# Altium schematic sheet Knobber_Topsheet.SchDoc
size A3; SheetNumber: 1; SheetTotal: 1
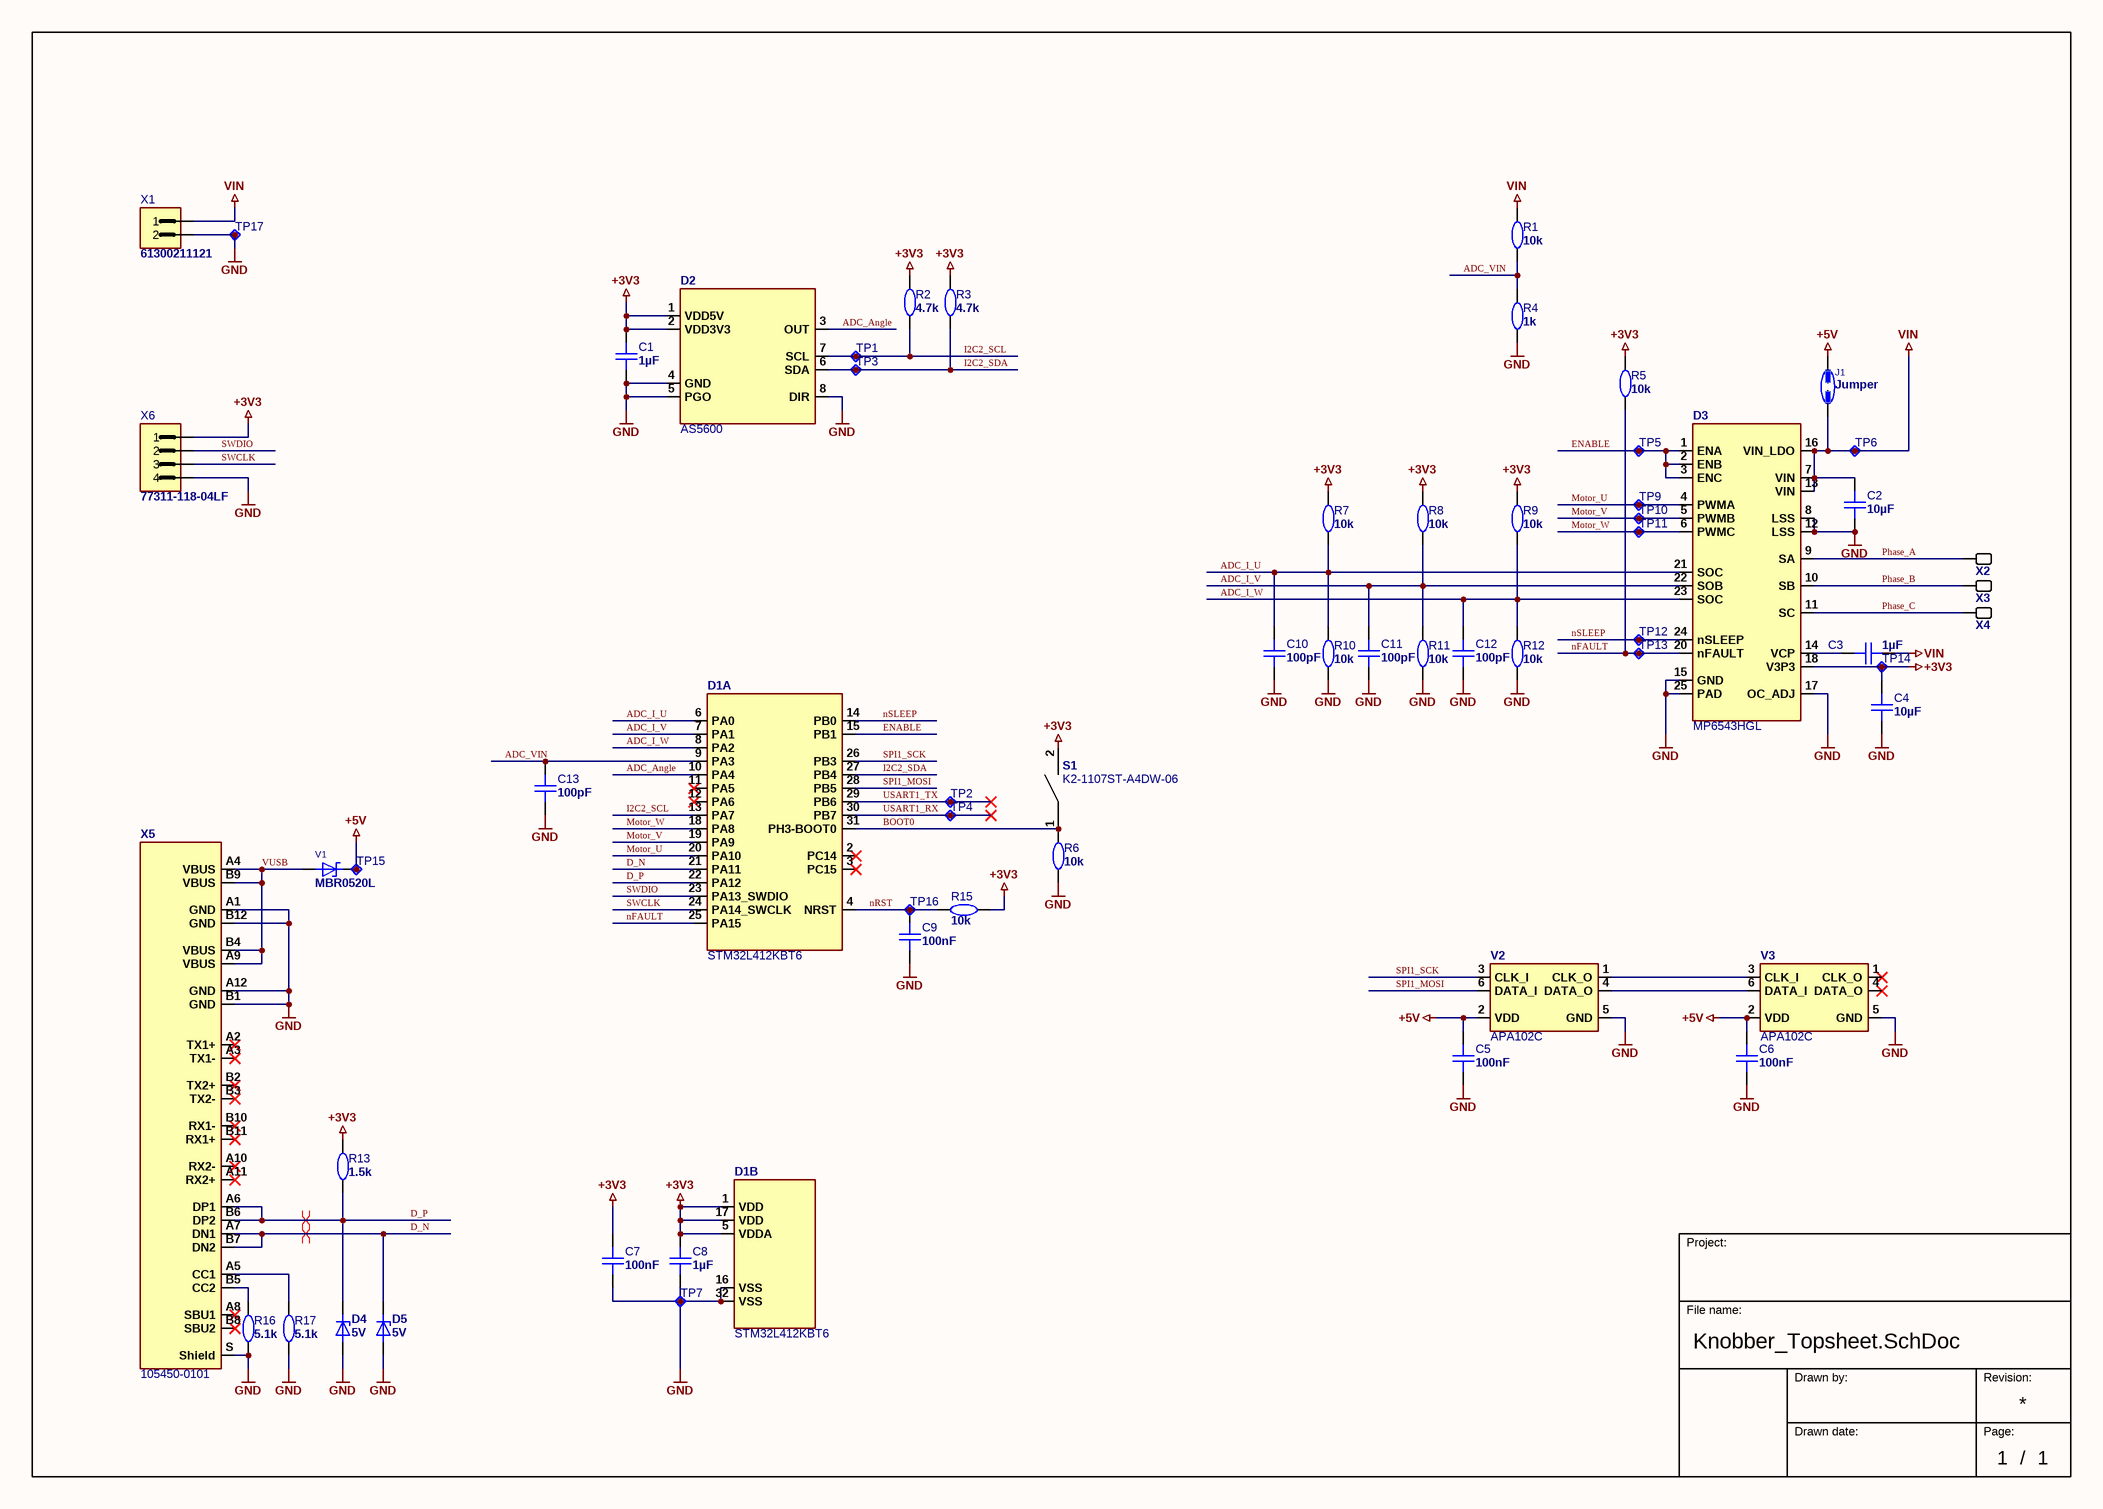
[diagram p0: Knobber_Topsheet.SchDoc]

## Parts
C1  value 1µF  [C-0603_1608_095_L_RF]  (hidden comment: Cap 1u 0603)
C2  value 10µF  [C-1210_3225_230_L_RF]  (hidden comment: CAP 10u 1210)
C3  value 1µF  [C-0603_1608_095_L_RF]  (hidden comment: Cap 1u 0603)
C4  value 10µF  [C-0805_2012_145_L_RF]  (hidden comment: CAP 10u 16V 0805)
C5  value 100nF  [C-0603_1608_095_L_RF]  (hidden comment: Cap 100n 0603)
C6  value 100nF  [C-0603_1608_095_L_RF]  (hidden comment: Cap 100n 0603)
C7  value 100nF  [C-0603_1608_095_L_RF]  (hidden comment: Cap 100n 0603)
C8  value 1µF  [C-0603_1608_095_L_RF]  (hidden comment: Cap 1u 0603)
C9  value 100nF  [C-0603_1608_095_L_RF]  (hidden comment: Cap 100n 0603)
C10  value 100pF  [C-0603_1608_095_L_RF]  (hidden comment: Cap 100p 0603)
C11  value 100pF  [C-0603_1608_095_L_RF]  (hidden comment: Cap 100p 0603)
C12  value 100pF  [C-0603_1608_095_L_RF]  (hidden comment: Cap 100p 0603)
C13  value 100pF  [C-0603_1608_095_L_RF]  (hidden comment: Cap 100p 0603)
D1  STM32L412KBT6  [LQFP32_N_RF]  (parts A,B of 2)
D2  AS5600  [SOIC8_N_RF]
D3  MP6543HGL  [QFN24_5x7_N_RF]
D4  5V  [SOD-923_N_RF]
D5  5V  [SOD-923_N_RF]
J1  value Jumper  [J-1206_Solderjumper_2Pin]  (hidden comment: Solder jumper 2Pin)  (no BOM)
R1  value 10k  [R-0603_1608_050_L_RF]  (hidden comment: Res 10k 0603)
R2  value 4.7k  [R-0603_1608_050_L_RF]  (hidden comment: Res 4k7 0603)
R3  value 4.7k  [R-0603_1608_050_L_RF]  (hidden comment: Res 4k7 0603)
R4  value 1k  [R-0603_1608_050_L_RF]  (hidden comment: Res 1k 0603)
R5  value 10k  [R-0603_1608_050_L_RF]  (hidden comment: Res 10k 0603)
R6  value 10k  [R-0603_1608_050_L_RF]  (hidden comment: Res 10k 0603)
R7  value 10k  [R-0603_1608_050_L_RF]  (hidden comment: Res 10k 0603)
R8  value 10k  [R-0603_1608_050_L_RF]  (hidden comment: Res 10k 0603)
R9  value 10k  [R-0603_1608_050_L_RF]  (hidden comment: Res 10k 0603)
R10  value 10k  [R-0603_1608_050_L_RF]  (hidden comment: Res 10k 0603)
R11  value 10k  [R-0603_1608_050_L_RF]  (hidden comment: Res 10k 0603)
R12  value 10k  [R-0603_1608_050_L_RF]  (hidden comment: Res 10k 0603)
R13  value 1.5k  [R-0603_1608_050_L_RF]  (hidden comment: Res 1k5 0603)
R15  value 10k  [R-0603_1608_050_L_RF]  (hidden comment: Res 10k 0603)
R16  value 5.1k  [R-0603_1608_050_L_RF]  (hidden comment: Res 5k1 0603)
R17  value 5.1k  [R-0603_1608_050_L_RF]  (hidden comment: Res 5k1 0603)
S1  K2-1107ST-A4DW-06  [K2-1107ST-A4DW-06]
TP1  TestPoint 0.8mm  [TP_0.8mm]  (value not drawn)  (no BOM)
TP2  TestPoint 0.8mm  [TP_0.8mm]  (value not drawn)  (no BOM)
TP3  TestPoint 0.8mm  [TP_0.8mm]  (value not drawn)  (no BOM)
TP4  TestPoint 0.8mm  [TP_0.8mm]  (value not drawn)  (no BOM)
TP5  TestPoint 0.8mm  [TP_0.8mm]  (value not drawn)  (no BOM)
TP6  TestPoint 0.8mm  [TP_0.8mm]  (value not drawn)  (no BOM)
TP7  TestPoint 0.8mm  [TP_0.8mm]  (value not drawn)  (no BOM)
TP9  TestPoint 0.8mm  [TP_0.8mm]  (value not drawn)  (no BOM)
TP10  TestPoint 0.8mm  [TP_0.8mm]  (value not drawn)  (no BOM)
TP11  TestPoint 0.8mm  [TP_0.8mm]  (value not drawn)  (no BOM)
TP12  TestPoint 0.8mm  [TP_0.8mm]  (value not drawn)  (no BOM)
TP13  TestPoint 0.8mm  [TP_0.8mm]  (value not drawn)  (no BOM)
TP14  TestPoint 0.8mm  [TP_0.8mm]  (value not drawn)  (no BOM)
TP15  TestPoint 0.8mm  [TP_0.8mm]  (value not drawn)  (no BOM)
TP16  TestPoint 0.8mm  [TP_0.8mm]  (value not drawn)  (no BOM)
TP17  TestPoint 0.8mm  [TP_0.8mm]  (value not drawn)  (no BOM)
V1  MBR0520L  [SOD123_L_RF]
V2  APA102C  [V_2020_P6_N_RF]
V3  APA102C  [V_2020_P6_N_RF]
X1  value 61300211121  [X-0508X0254_R_WE_61300211121]  (hidden comment: CONN HEADER 2POS 1ROW THT 2.54MM)
X2  (no value)  [Lötpad_2x3]  (no BOM)
X3  (no value)  [Lötpad_2x3]  (no BOM)
X4  (no value)  [Lötpad_2x3]  (no BOM)
X5  105450-0101  [105450-0101]
X6  value 77311-118-04LF  [X-0101X0025_R_FCI_77311-118-04LF]  (hidden comment: CONN HEADER 4POS 1ROW THT 2.54MM)

## Nets
+3V3: C1.2 C4.2 C7.2 C8.2 D1.1(VDD) D1.5(VDDA) D1.17(VDD) D2.1(VDD5V) D2.2(VDD3V3) D3.18(V3P3) R2.2 R3.2 R5.2 R7.2 R8.2 R9.2 R13.2 R15.1 S1.2 TP14.1 X6.1
+5V: C5.2 C6.2 J1.2 TP15.1 V1.2 V2.2(VDD) V3.2(VDD)
GND: C1.1 C2.1 C4.1 C5.1 C6.1 C7.1 C8.1 C9.1 C10.1 C11.1 C12.1 C13.1 D1.16(VSS) D1.32(VSS) D2.4(GND) D2.5(PGO) D2.8(DIR) D3.8(LSS) D3.12(LSS) D3.15(GND) D3.17(OC_ADJ) D3.25(PAD) D4.1 D5.1 R4.1 R6.1 R10.1 R11.1 R12.1 R16.1 R17.1 TP7.1 TP17.1 V2.5(GND) V3.5(GND) X1.2 X5.A1(GND) X5.A12(GND) X5.B1(GND) X5.B12(GND) X5.S(Shield) X6.4
VIN: C2.2 C3.2 D3.7(VIN) D3.13(VIN) D3.16(VIN_LDO) J1.1 R1.2 TP6.1 X1.1
ADC_Angle: D1.10(PA4) D2.3(OUT)
ADC_I_U: C10.2 D1.6(PA0) D3.21(SOC) R7.1 R10.2
ADC_I_V: C11.2 D1.7(PA1) D3.22(SOB) R8.1 R11.2
ADC_I_W: C12.2 D1.8(PA2) D3.23(SOC) R9.1 R12.2
ADC_VIN: C13.2 D1.9(PA3) R1.1 R4.2
BOOT0: D1.31(PH3-BOOT0) R6.2 S1.1
D_N: D1.21(PA11) D5.2 X5.A7(DN1) X5.B7(DN2)
D_P: D1.22(PA12) D4.2 R13.1 X5.A6(DP1) X5.B6(DP2)
ENABLE: D1.15(PB1) D3.1(ENA) D3.2(ENB) D3.3(ENC) TP5.1
I2C2_SCL: D1.13(PA7) D2.7(SCL) R2.1 TP1.1
I2C2_SDA: D1.27(PB4) D2.6(SDA) R3.1 TP3.1
Motor_U: D1.20(PA10) D3.4(PWMA) TP9.1
Motor_V: D1.19(PA9) D3.5(PWMB) TP10.1
Motor_W: D1.18(PA8) D3.6(PWMC) TP11.1
nFAULT: D1.25(PA15) D3.20(nFAULT) R5.1 TP13.1
nRST: C9.2 D1.4(NRST) R15.2 TP16.1
nSLEEP: D1.14(PB0) D3.24(nSLEEP) TP12.1
Phase_A: D3.9(SA) X2.1
Phase_B: D3.10(SB) X3.1
Phase_C: D3.11(SC) X4.1
SPI1_MOSI: D1.28(PB5) V2.6(DATA_I)
SPI1_SCK: D1.26(PB3) V2.3(CLK_I)
SWCLK: D1.24(PA14_SWCLK) X6.3
SWDIO: D1.23(PA13_SWDIO) X6.2
USART1_RX: D1.30(PB7) TP4.1
USART1_TX: D1.29(PB6) TP2.1
VUSB: V1.1 X5.A4(VBUS) X5.A9(VBUS) X5.B4(VBUS) X5.B9(VBUS)
NetC3_1: C3.1 D3.14(VCP)
NetR16_2: R16.2 X5.B5(CC2)
NetR17_2: R17.2 X5.A5(CC1)
NetV2_1: V2.1(CLK_O) V3.3(CLK_I)
NetV2_4: V2.4(DATA_O) V3.6(DATA_I)

Not connected (* = marked no-connect by the designer): D1 2(PC14)* 3(PC15)* 11(PA5)* 12(PA6)*; V3 1(CLK_O)* 4(DATA_O)*; X5 A2(TX1+)* A3(TX1-)* A8(SBU1)* A10(RX2-)* A11(RX2+)* B2(TX2+)* B3(TX2-)* B8(SBU2)* B10(RX1-)* B11(RX1+)*

## Layout directives
differential pair: D_N, D_P

## Notes on the sheet
- Project:
- File name:
- Drawn by:
- Revision:
- Drawn date:
- Page:
- /

## Library data of the parts
C1 C3 C8 = CMP-001-0045-3: Cap Cer SMD 1u 16V 10% 0603 X7R; Manufacturer Part Number: 0603YC105KAT2A; Manufacturer: AVX; GPV_Number: 1749.0125; User: epph; Prefered: true; Manufacturer Part Number 2: C0603C105K4RACTU; ClassName: Surface_Assy; Technology: SMT; Manufacturer 2: KEMET; PartStatus: Release; Case / Package: 0603
C2 = CMP-001-0198-2: CAP CER 10uF 50V X7S 1210; Manufacturer: TDK; Manufacturer Part Number: C3225X7S1H106K250AE; User: zupa; GPV_Number: 1752.0100; Technology: SMT; ClassName: Surface_Assy; ComponentLink1Description: Datasheet; PartStatus: Release; ComponentLink1URL: https://datasheet.ciiva.com/24218/c3225x7s1h106k250ae-265440-24218657.pdf?src-supplier=Mouser; Case / Package: 1210
C4 = CMP-001-0177-2: Cap Cer SMD 10u 16V 10% 0805 X5R; Manufacturer Part Number: 0805YD106KAT2A; Manufacturer: AVX; Prefered: true; GPV_Number: 1750.0241; User: zupa; PartStatus: Release; ComponentLink1URL: https://datasheet.ciiva.com/152/cx5r-152114.pdf; Case / Package: 0805; ComponentLink1Description: Datasheet; Technology: SMT; ClassName: Surface_Assy
C5-C7 C9 = CMP-001-0036-2: Cap Cer SMD 100n 100V 10% 0603 X7R; Manufacturer Part Number: GRM188R72A104KA35; Manufacturer: MURATA; GPV_Number: 1749.0196; User: zupa; Prefered: false; Case / Package: 0603; ComponentLink1Description: Datasheet; PartStatus: Release; ComponentLink1URL: https://datasheet.ciiva.com/34302/1857815-34302863.pdf; ClassName: Surface_Assy; Technology: SMT
C10-C13 = CMP-001-0000-2: Cap Cer SMD 100p 50V 5% 0603 C0G; Manufacturer Part Number: CC0603J*NPO9BN101; Manufacturer: YAGEO; User: zupa; GPV_Number: 1749.0055; Prefered: false; Technology: SMT; PartStatus: Release; Case / Package: 0603; ComponentLink1Description: Datasheet; ComponentLink1URL: https://datasheet.ciiva.com/11786/0900766b8079c870-11786060.pdf; ClassName: Surface_Assy
D1 = STM32L412KBT6: IC MCU STM32; Part_validated: No; Manufacturer: STM; GPV_Number: xxxx.xxxx; MNL_Number: xxxxxxxx; Value: STM32L412KBT6; Footprint_validated: No; PartStatus: New; System: -; Case/Package: LQFP32; Technology: SMT; Manufacturer Part Number: STM32L412KBT6; ClassName: Surface_Assy
D2 = AS5600: IC Sensor Rotation Magnet 12bit; Part_validated: No; Manufacturer: AMS; GPV_Number: xxxx.xxxx; MNL_Number: xxxxxxxx; Value: AS5600; Footprint_validated: No; PartStatus: New; System: -; ClassName: Surface_Assy; Case/Package: SO-8; Technology: SMT; Manufacturer Part Number: AS5600
D3 = MP6543HGL-A-P: Motor Driver 3-Phase 3-22V 2A; Part_validated: No; Manufacturer: Monolithic Power Systems; GPV_Number: xxxx.xxxx; MNL_Number: xxxxxxxx; Value: MP6543HGL; Footprint_validated: No; PartStatus: New; System: -; ClassName: Surface_Assy; Case/Package: QFN-24; Technology: SMT; Manufacturer Part Number: MP6543HGL-A-P
D4 D5 = ESD9101: Diode ESD 5V; Part_validated: Yes | No; Manufacturer: Onsemi; Manufacturer Part Number: ESD9101P2T5G; GPV_Number: xxxx.xxxx; MNL_Number: xxxxxxxx; Value: 5V; Footprint_validated: Yes | No; PartStatus: New | Draft | Release; System: -; ClassName: Surface_Assy | Testpoint | Through-Hole_Assy | NetTie | Symbol | Mechanical; Case/Package: 0201 | 0402 | 0603 | 0805 | 1206 | SO8 | SO16 |; Technology: SMT | THT | SMT-BTC
J1 = CMP-00136-2: User: epph; PartStatus: Release; ClassName: Surface_Assy; Technology: SYM
R1 R5-R12 R15 = CMP-001-0241-4: Res SMD 10k 1% 0.1W 0603; Manufacturer: KOA; Manufacturer Part Number: RK73H1JTTD1002F; GPV_Number: 1922.0100; User: epph; Prefered: true; Case / Package: 0603; ClassName: Surface_Assy; PartStatus: Release; Technology: SMT; Manufacturer Part Number 3: RC0603FR-0710KL; Manufacturer 3: YAGEO; Manufacturer 2: Vishay; Manufacturer Part Number 2: CRCW060310K0FKEA
R2 R3 = CMP-001-0274-3: Res SMD 4k7 1% 0.1W 0603; Manufacturer Part Number: RC0603FR-074K7L; Manufacturer: YAGEO; GPV_Number: 1922.0017; Prefered: true; MNL_Number: 15347012; User: zupa; ComponentLink1Description: Datasheet; ComponentLink1URL: https://datasheet.ciiva.com/11808/0900766b80f96399-11808280.pdf; ClassName: Surface_Assy; PartStatus: Release; Case / Package: 0603; Technology: SMT
R4 = CMP-001-0250-3: Res SMD 1k 1% 0.1W 0603; Manufacturer: YAGEO; Manufacturer Part Number: RC0603FR-071KL; MNL_Number: 15310012; User: zupa; GPV_Number: 1922.0011; Prefered: true; Technology: SMT; ComponentLink1Description: Datasheet; ClassName: Surface_Assy; ComponentLink1URL: https://datasheet.ciiva.com/11808/0900766b80f96399-11808280.pdf; Case / Package: 0603; PartStatus: Release
R13 = CMP-001-0572-4: Res SMD 1k5 1% 0.1W 0603; Manufacturer: YAGEO; Manufacturer Part Number: RC0603FR-071K5L; User: epph; Prefered: true; GPV_Number: 1922.0480; Manufacturer 2: KOA; Case / Package: 0603; PartStatus: Release; Manufacturer 3: Vishay; Technology: SMT; ClassName: Surface_Assy; Manufacturer Part Number 3: CRCW06031K50FKEA; Manufacturer Part Number 2: RK73H1JTTD1501F
R16 R17 = CMP-001-0582-3: Res SMD 5k1 1% 0.1W 0603; Manufacturer Part Number: RC0603FR-075K1L; Manufacturer: YAGEO; Prefered: true; GPV_Number: 1922.0144; User: napa; Technology: SMT; ComponentLink1URL: https://datasheet.ciiva.com/8895/pyu-rc0603-51-rohs-l-4-8895189.pdf; PartStatus: Release; ClassName: Surface_Assy; ComponentLink1Description: Datasheet; Case / Package: 0603
S1 = K2-1107ST-A4DW-06: BUTTON tactile 12V 50mA; Part_validated: No; Manufacturer: HROparts; Manufacturer Part Number: K2-1107ST-A4DW-06 (C118141); GPV_Number: xxxx.xxxx; MNL_Number: xxxxxxxx; Value: K2-1107ST-A4DW-06; Footprint_validated: No; PartStatus: New; System: -; ClassName: Surface_Assy; Case/Package: 4pin; Technology: SMT
TP1-TP7 TP9-TP17 = CMP-001-1515-1: Value: TP; User: zupa; ClassName: Testpoint; GPV_Number: -; PartStatus: Release; Technology: SMT
V1 = CMP-001-1324-3: Diode Schottky 20V 0.5A SOD123; Manufacturer: ONSemi; Manufacturer Part Number: MBR0520LT1G; GPV_Number: 1600.2395; User: epph; Prefered: false; Technology: SMT; ClassName: Surface_Assy; PartStatus: Release; Value: MBR0520L; Case / Package: SOD123
V2 V3 = APA102C: RGB LED SPI Interface; Part_validated: No; Manufacturer: APA Electronic CO; Manufacturer Part Number: APA-102-2020-256-8A; GPV_Number: xxxx.xxxx; MNL_Number: xxxxxxxx; Value: APA102C; Footprint_validated: No; PartStatus: New; System: -; ClassName: Surface_Assy; Case/Package: 2020; Technology: SMT
X1 = CMP-00105-3: CONN HEADER 2POS 1ROW THT 2.54MM WE 61300211121; System: Connector; User: balu; ComponentLink1URL: https://www.we-online.com/katalog/datasheet/6130xx11121.pdf; Manufacturer Part Number: 61300211121; ComponentLink1Description: Datasheet; GPV_Number: *; PartStatus: Release; Technology: THT; ClassName: Through-Hole_Assy; Manufacturer: WE
X2-X4 = Lötpad_2mmx3mm: Solderpad 2mm x 3mm; Part_validated: No; GPV_Number: xxxx.xxxx; System: Connector; MNL_Number: xxxxxxxx; Footprint_validated: No; PartStatus: New; ClassName: Testpoint; Case/Package: -; Technology: SMT; Manufacturer: -; Manufacturer Part Number: -
X5 = 105450-0101: CONN USB-C 16pin; Part_validated: No; Manufacturer: Molex; GPV_Number: xxxx.xxxx; System: Connector; MNL_Number: xxxxxxxx; Value: 105450-0101; Footprint_validated: No; PartStatus: New; ClassName: Through-Hole_Assy; Case/Package: USB-C; Technology: SMT; Manufacturer Part Number: 105450-0101
X6 = CMP-001-1284-4: CONN HEADER 4POS 1ROW THT 2.54MM FCI 77311-118-04LF; System: Connector; GPV_Number: 4401.2630; User: zupa; Manufacturer: FCI; Technology: THT; PartStatus: Release; ClassName: Through-Hole_Assy; Manufacturer Part Number: 77311-118-04LF; ComponentLink1URL: http://portal.fciconnect.com/Comergent//fci/drawing/77311.pdf; ComponentLink1Description: Datasheet